# EAGLE design InterfazSensores (EAGLE 7.6.0)
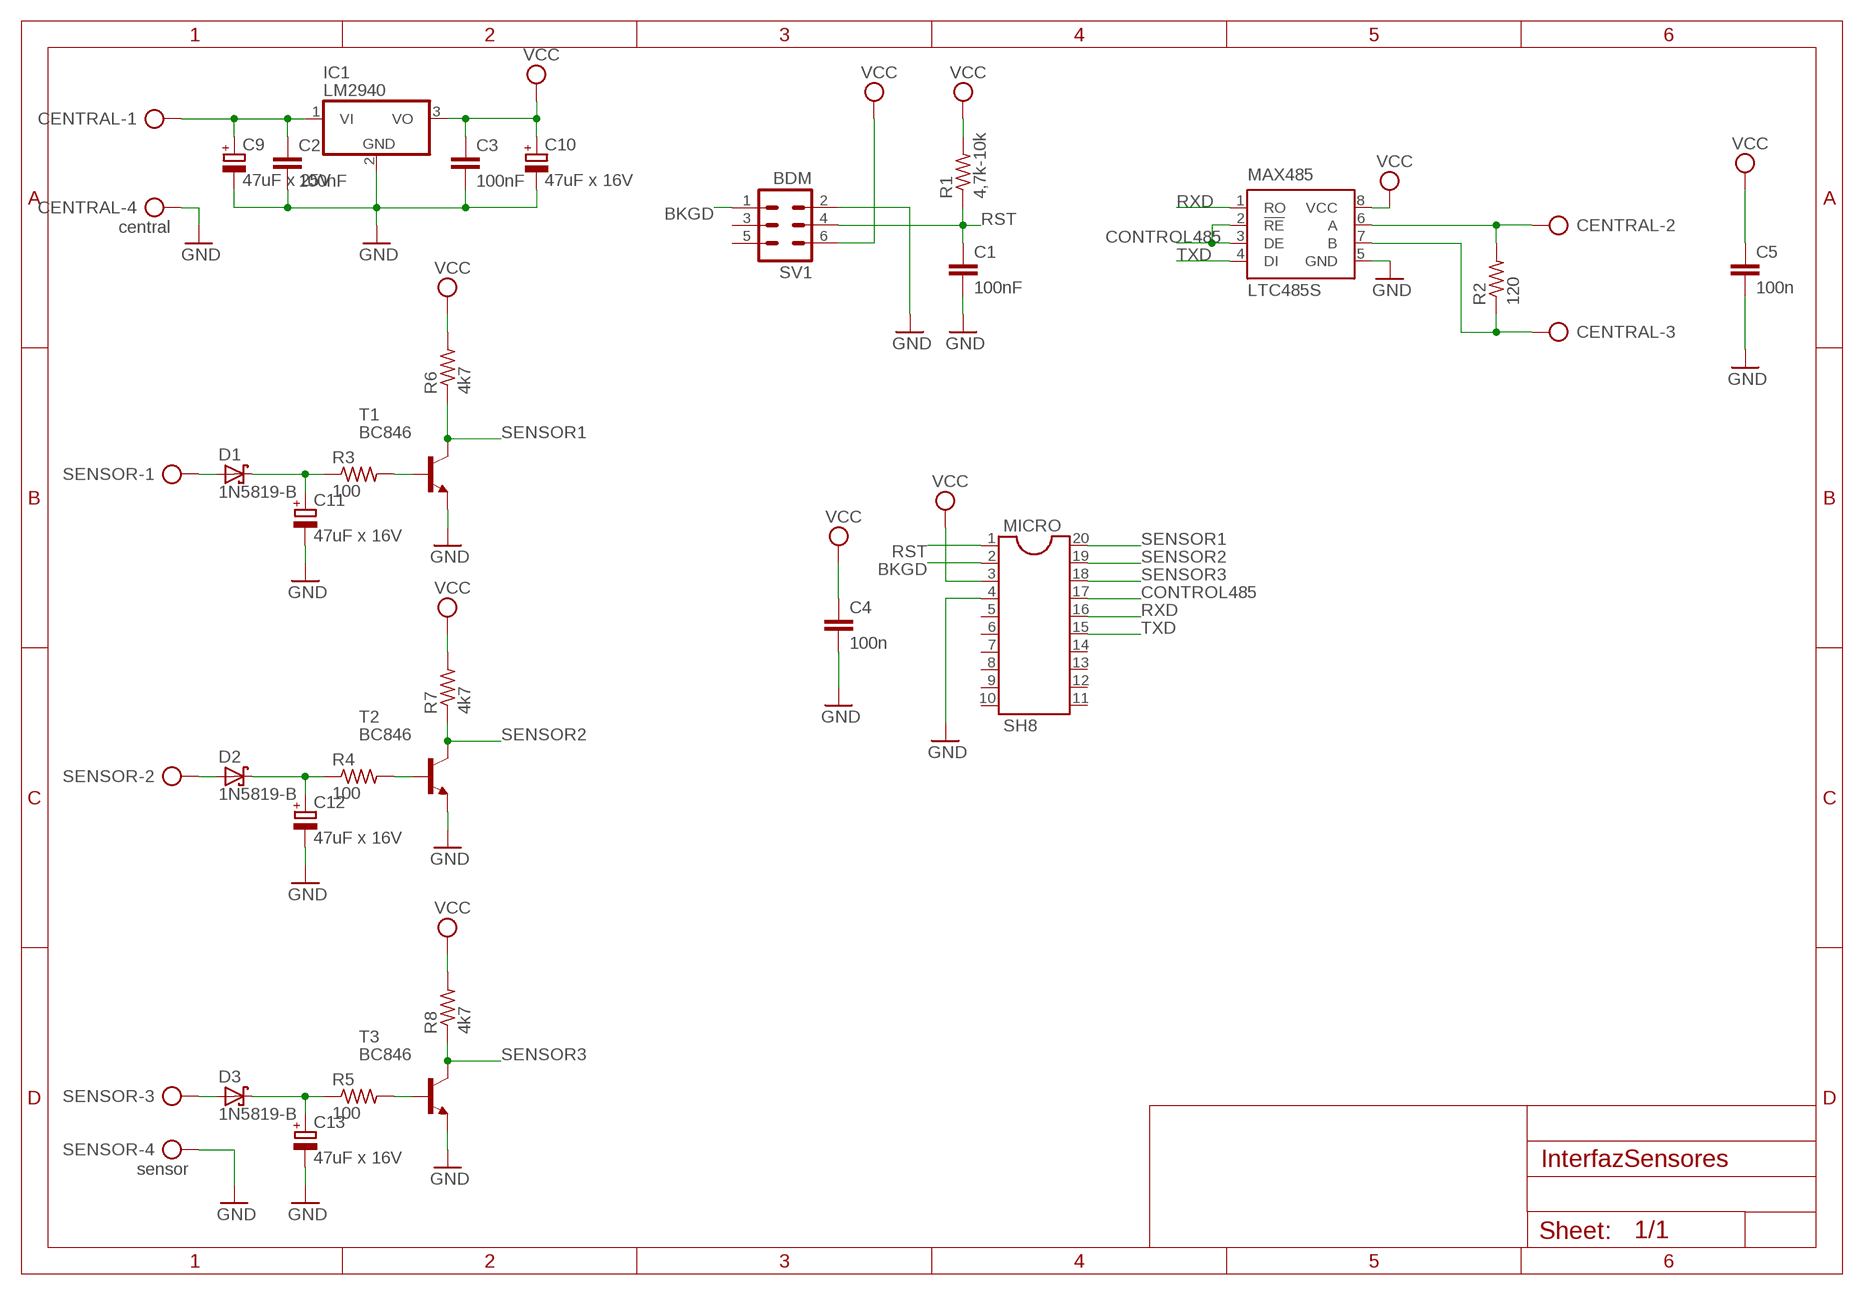
[diagram p0: schematic, sheet 1]

## Parts
C1  100nF  C-EUC0805  [C0805]
C2  100nF  C-EUC0805  [C0805]
C3  100nF  C-EUC0805  [C0805]
C4  100n  C-EUC0805  [C0805]
C5  100n  C-EUC0805  [C0805]
C9  47uF x 25V  CPOL-EUE2,5-6E  [E2,5-6E]
C10  47uF x 16V  CPOL-EUE2,5-6E  [E2,5-6E]
C11  47uF x 16V  CPOL-EUE2,5-6E  [E2,5-6E]
C12  47uF x 16V  CPOL-EUE2,5-6E  [E2,5-6E]
C13  47uF x 16V  CPOL-EUE2,5-6E  [E2,5-6E]
CENTRAL  central  AK300/4  [AK300/4]
D1  1N5819-B  [DO41-7.6]
D2  1N5819-B  [DO41-7.6]
D3  1N5819-B  [DO41-7.6]
IC1  LM2940  7805TV  [TO220V]
MAX485  LTC485S  [SOIC8]
MICRO  SH8  DIL20  [DIL20]
R1  4,7k-10k  R-US_R0805  [R0805]
R2  120  R-US_R0805  [R0805]
R3  100  R-US_R0805  [R0805]
R4  100  R-US_R0805  [R0805]
R5  100  R-US_R0805  [R0805]
R6  4k7  R-US_R0805  [R0805]
R7  4k7  R-US_R0805  [R0805]
R8  4k7  R-US_R0805  [R0805]
SENSOR  sensor  AK300/4  [AK300/4]
SV1  BDM  MA03-2  [MA03-2]
T1  BC846  [SOT23]
T2  BC846  [SOT23]
T3  BC846  [SOT23]

## Nets
BKGD: MICRO.2 SV1.1
CONTROL485: MAX485.2(!RE) MAX485.3(DE) MICRO.17
GND: C1.2 C2.2 C3.2 C4.2 C5.2 C9.- C10.- C11.- C12.- C13.- CENTRAL.4 IC1.2(GND) MAX485.5(GND) MICRO.4 SENSOR.4 SV1.2 T1.2(E) T2.2(E) T3.2(E)
N$1: C2.1 C9.+ CENTRAL.1 IC1.1(VI)
N$2: CENTRAL.2 MAX485.6(A) R2.2
N$3: CENTRAL.3 MAX485.7(B) R2.1
N$4: D1.A SENSOR.1
N$5: D2.A SENSOR.2
N$6: D3.A SENSOR.3
N$7: C11.+ D1.C R3.1
N$8: C12.+ D2.C R4.1
N$9: C13.+ D3.C R5.1
N$10: R5.2 T3.1(B)
N$12: R4.2 T2.1(B)
N$14: R3.2 T1.1(B)
RST: C1.1 MICRO.1 R1.1 SV1.4
RXD: MAX485.1(RO) MICRO.16
SENSOR1: MICRO.20 R6.1 T1.3(C)
SENSOR2: MICRO.19 R7.1 T2.3(C)
SENSOR3: MICRO.18 R8.1 T3.3(C)
TXD: MAX485.4(DI) MICRO.15
VCC: C3.1 C4.1 C5.1 C10.+ IC1.3(VO) MAX485.8(VCC) MICRO.3 R1.2 R6.2 R7.2 R8.2 SV1.6
Unconnected: MICRO.5 MICRO.6 MICRO.7 MICRO.8 MICRO.9 MICRO.10 MICRO.11 MICRO.12 MICRO.13 MICRO.14 SV1.3 SV1.5

## Library data of the parts
C1-C5 = resistor:C-EU: CAPACITOR, European symbol
C9-C13 = rcl:CPOL-EU: POLARIZED CAPACITOR, European symbol
CENTRAL SENSOR = con-ptr500:AK300/4: CONNECTOR; OC_FARNELL: unknown; OC_NEWARK: unknown
D1-D3 = diode:1N581*: 1.0A SCHOTTKY BARRIER RECTIFIER Source: http://www.diodes.com/datasheets/ds23001.pdf
IC1 = linear:78*: Positive VOLTAGE REGULATOR Source: http://cache.national.com/ds/LM/LM78L05.pdf http://www.fairchildsemi.com/ds/LM/LM7805.pdf
MAX485 = linear-technology:LTC485: Low Power RS485 Interface Transceiver Source: http://www.linear.com/pc/downloadDocument.do?navId=H0,C1,C1007,C1017,P2064,D1718; OC_FARNELL: unknown; OC_NEWARK: unknown
MICRO = ic-package:DIL20: Dual In Line / Socket
R1-R8 = resistor:R-US_: RESISTOR, American symbol
SV1 = con-lstb:MA03-2: PIN HEADER; OC_FARNELL: unknown; OC_NEWARK: unknown
T1-T3 = transistor:BC846: NPN TRANSISTOR

## Board
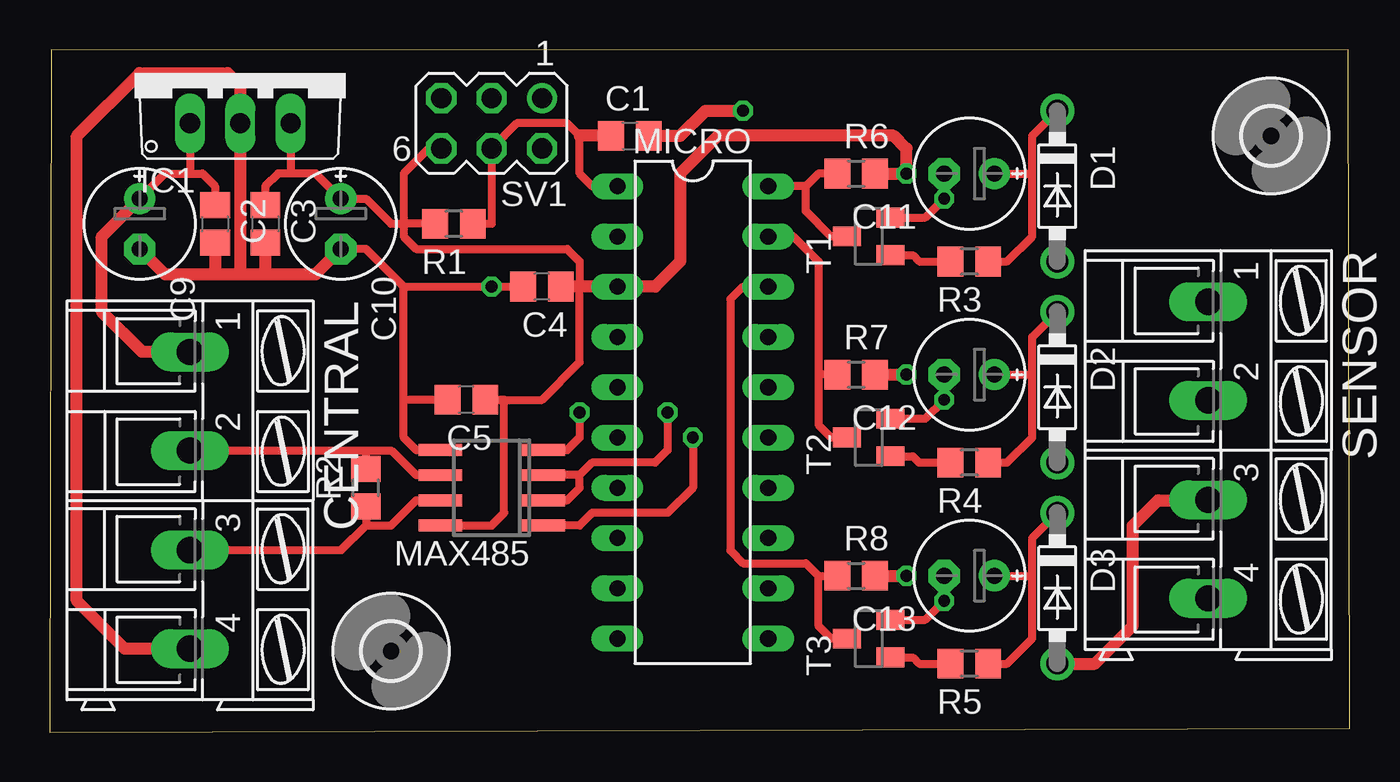
[diagram p1: board, top side]
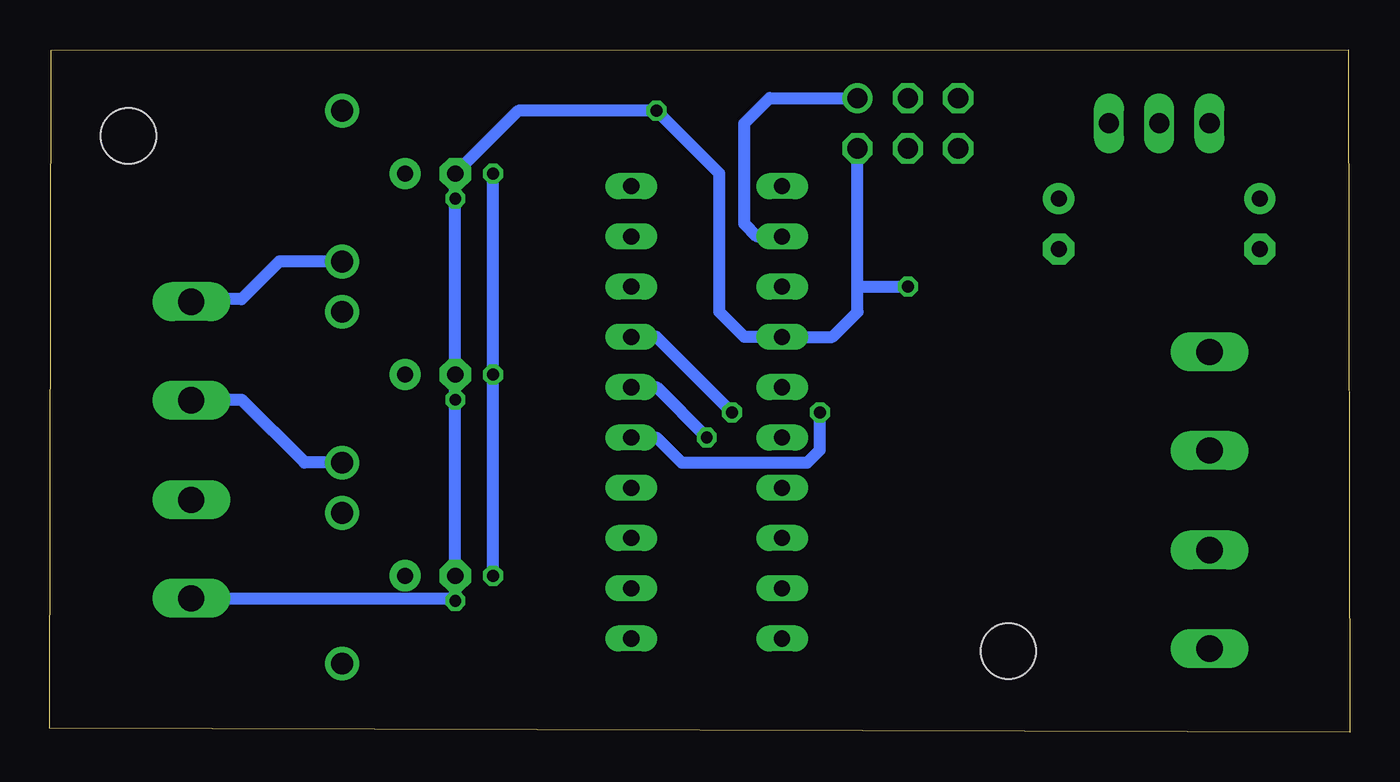
[diagram p2: board, bottom side, seen from below]

Size 65.69 x 34.5 mm. Coordinates in mm from the lower left corner, seen from the top.
Outline: 0.1,34.5 0,0 65.69,0.2 65.59,34.45 0.1,34.5
Copper layers (1*16): Top 0.035mm / dielectric 1.5mm / Bottom 0.035mm
Design rules "default": minimum track width 10mil, minimum drill 24mil, track to track 8mil, track to pad 8mil, pad to pad 8mil, via to via 8mil, smd to smd 8mil, copper to edge 40mil, drill to drill 8mil, minimum pad ring 10mil, minimum via ring 8mil, stop-mask expansion 4mil, vias tented up to drill 0mil, thermal gap 10mil

### Footprints (pad centres in the part's own frame; a part is rotated, then mirrored left to right if it is on the bottom)
C0805 = smd 1.3 x 1.5: 1 -0.95,0; 2 0.95,0
E2,5-6E = drill 0.813 pad 1.575: + -1.27,0 | drill 0.813 pad 1.575 octagon: - 1.27,0
AK300/4 = drill 1.321 long: 1 -7.493,0; 2 -2.515,0; 3 2.515,0; 4 7.493,0
DO41-7.6 = drill 1.1 pad 1.7: A 3.81,0; C -3.81,0
TO220V = drill 1.016 long: 1 -2.54,-2.54; 2 0,-2.54; 3 2.54,-2.54
SOIC8 = smd 0.6 x 2.2: 1 -1.905,-2.6; 2 -0.635,-2.6; 3 0.635,-2.6; 4 1.905,-2.6; 5 1.905,2.6; 6 0.635,2.6; 7 -0.635,2.6; 8 -1.905,2.6
DIL20 = drill 0.813 long: 1 -11.43,-3.81; 2 -8.89,-3.81; 3 -6.35,-3.81; 4 -3.81,-3.81; 5 -1.27,-3.81; 6 1.27,-3.81; 7 3.81,-3.81; 8 6.35,-3.81; 9 8.89,-3.81; 10 11.43,-3.81; 11 11.43,3.81; 12 8.89,3.81; 13 6.35,3.81; 14 3.81,3.81; 15 1.27,3.81; 16 -1.27,3.81; 17 -3.81,3.81; 18 -6.35,3.81; 19 -8.89,3.81; 20 -11.43,3.81
R0805 = smd 1.3 x 1.5: 1 -0.95,0; 2 0.95,0
MA03-2 = drill 1.016: 1 -2.54,-1.27 | drill 1.016 octagon: 2 -2.54,1.27; 3 0,-1.27; 4 0,1.27; 5 2.54,-1.27; 6 2.54,1.27
SOT23 = smd 1 x 1.4: 1 -0.95,-1.1; 2 0.95,-1.1; 3 0,1.1
2,8 = hole 2.8: 0,0

### Placement (x,y rotation side)
C1  29.32,30.13 0 top
C2  8.37,25.69 270 top
C3  10.9,25.69 270 top
C4  24.88,22.52 180 top
C5  21.06,16.8 180 top
C9  4.56,25.69 270 top
C10  14.71,25.69 270 top
C11  46.46,28.23 180 top
C12  46.46,18.07 180 top
C13  46.46,7.91 180 top
CENTRAL  7.1,11.72 270 top
D1  50.91,27.59 270 top
D2  50.91,17.43 270 top
D3  50.91,7.28 270 top
IC1  9.63,33.31 0 top
MAX485  22.34,12.35 90 top
MICRO  32.49,16.16 270 top
R1  20.43,25.69 180 top
R2  15.98,12.35 90 top
R3  46.46,23.79 180 top
R4  46.46,13.62 180 top
R5  46.46,3.46 180 top
R6  40.75,28.23 0 top
R7  40.75,18.07 0 top
R8  40.75,7.91 0 top
SENSOR  58.53,14.26 270 top
SV1  22.34,30.77 180 top
T1  41.38,25.05 90 top
T2  41.38,14.89 90 top
T3  41.38,4.74 90 top
U$1  [2,8]  61.7,30.13 270 top
U$3  [2,8]  17.25,4.1 270 top

### Tracks (layer width: path | path; a pad name or v marks a point on that pad's centre or on a via)
BKGD
  Bottom 0.61: MICRO.2 29.95,25.05 30.59,25.69 30.59,30.77 29.32,32.04 SV1.1
CONTROL485  (via drill 0.6)
  Top 0.406: v31.22,16.16 31.22,14.26 30.59,13.62 27.41,13.62 26.78,12.99 | 26.78,12.99 MAX485.3 | MAX485.2 26.14,11.72 26.78,12.35 26.78,12.99
  Bottom 0.61: MICRO.17 35.03,19.97 v31.22,16.16
GND  (via drill 0.6)
  Top 0.406: T3.2 44.24,5.68 v45.2,6.64 C13.- | T2.2 44.24,15.84 v45.2,16.8 C12.- | T1.2 44.24,26 v45.2,26.96 C11.- | MAX485.5 18.52,14.26 17.89,14.89 17.89,16.8 | C5.2 17.89,16.8 | 17.89,16.8 17.89,22.52 | 17.89,22.52 15.98,24.42 C10.- | 17.89,22.52 v22.34,22.52 C4.2
  Top 0.61: C9.- 5.83,23.15 8.37,23.15 | 8.37,23.15 9.63,23.15 | 9.63,23.15 10.9,23.15 | 10.9,23.15 13.45,23.15 C10.- | C3.2 10.9,23.15 | C2.2 8.37,23.15 | C1.2 31.86,30.13 33.13,31.4 v35.03,31.4 | CENTRAL.4 3.79,4.23 1.38,6.64 1.38,30.13 4.56,33.31 9,33.31 9.63,32.67 IC1.2 9.63,23.15
  Bottom 0.61: SENSOR.4 45.32,6.77 v45.2,6.64 | C13.- v45.2,6.64 | v45.2,6.64 v45.2,16.8 C12.- v45.2,26.96 C11.- 42.02,31.4 v35.03,31.4 31.86,28.23 31.86,21.24 30.59,19.97 MICRO.4 26.14,19.97 24.88,21.24 24.88,22.52 | 24.88,22.52 SV1.2 | 24.88,22.52 v22.34,22.52
N$1
  Top 0.406: C9.+ 5.83,28.23 7.1,28.23 | 7.1,28.23 7.73,28.23 8.37,27.59 C2.1 | IC1.1 7.1,28.23
  Top 0.61: CENTRAL.1 4.68,19.21 2.65,21.24 2.65,25.05 C9.+
N$2
  Top 0.406: CENTRAL.2 15.98,14.23 | 15.98,14.23 17.28,14.23 18.52,12.99 MAX485.6 | R2.2 15.98,14.23
N$3
  Top 0.406: CENTRAL.3 14.74,9.2 15.98,10.45 | 15.98,10.45 17.25,10.45 18.52,11.72 MAX485.7 | R2.1 15.98,10.45
N$4
  Bottom 0.61: D1.A 54.09,23.79 55.99,21.88 58.4,21.88 SENSOR.1
N$5
  Bottom 0.61: D2.A 52.81,13.62 55.99,16.8 58.51,16.8 SENSOR.2
N$6
  Top 0.61: D3.A 52.81,3.46 54.72,5.37 54.72,10.45 55.99,11.72 58.51,11.72 SENSOR.3
N$7
  Top 0.406: R3.1 48.37,23.79 49.64,25.05 49.64,28.23 | 49.64,28.23 49.64,30.13 D1.C | C11.+ 49.64,28.23
N$8
  Top 0.406: R4.1 48.37,13.62 49.64,14.89 49.64,18.07 | 49.64,18.07 49.64,19.97 D2.C | C12.+ 49.64,18.07
N$9
  Top 0.406: R5.1 48.37,3.46 49.64,4.74 49.64,7.91 | 49.64,7.91 49.64,9.81 D3.C | C13.+ 49.64,7.91
N$10
  Top 0.406: T3.1 43.6,3.79 43.92,3.46 R5.2
N$12
  Top 0.406: T2.1 43.6,13.94 43.92,13.62 R4.2
N$14
  Top 0.406: T1.1 43.6,24.11 43.92,23.79 R3.2
RST
  Top 0.406: R1.1 22.34,25.69 SV1.4 23.61,30.77 26.14,30.77 26.78,30.13 26.78,28.23 27.41,27.59 MICRO.1
  Top 0.61: C1.1 26.78,30.13
RXD  (via drill 0.6)
  Top 0.406: v32.49,14.89 32.49,12.35 31.22,11.08 27.41,11.08 26.78,10.45 MAX485.1
  Bottom 0.61: MICRO.16 35.03,17.43 v32.49,14.89
SENSOR1
  Top 0.406: T1.3 39.48,25.05 38.21,26.32 38.21,27.59 | 38.21,27.59 MICRO.20 | R6.1 38.84,28.23 38.21,27.59
SENSOR2
  Top 0.406: MICRO.19 37.58,25.05 38.84,23.79 38.84,18.07 | 38.84,18.07 38.84,15.53 39.48,14.89 T2.3 | R7.1 38.84,18.07
SENSOR3
  Top 0.406: MICRO.18 35.03,22.52 34.4,21.88 34.4,9.18 35.03,8.54 38.21,8.54 38.84,7.91 | 38.84,7.91 R8.1 | T3.3 39.48,4.74 38.84,5.37 38.84,7.91
TXD  (via drill 0.6)
  Top 0.406: v26.78,16.16 26.78,14.89 26.14,14.26 MAX485.4
  Bottom 0.61: MICRO.15 35.03,14.89 33.77,13.62 27.41,13.62 26.78,14.26 v26.78,16.16
VCC  (via drill 0.6)
  Top 0.406: 12.17,28.23 13.45,28.23 C10.+ 15.98,26.96 17.25,25.69 17.89,25.69 | 12.17,28.23 11.54,28.23 10.9,27.59 C3.1 | IC1.3 12.17,28.23 | SV1.6 19.16,29.5 17.89,28.23 17.89,25.69 | R1.2 17.89,25.69 | 17.89,25.69 17.89,25.05 18.52,24.42 26.14,24.42 26.78,23.79 26.78,22.52 26.78,18.7 24.88,16.8 C5.1 22.97,16.8 22.97,11.08 22.34,10.45 MAX485.8
  Top 0.61: R6.2 v43.29,28.23 43.29,29.5 42.66,30.13 33.77,30.13 31.86,28.23 31.86,23.79 30.59,22.52 MICRO.3 26.78,22.52 C4.1 | R8.2 v43.29,7.91 | R7.2 v43.29,18.07
  Bottom 0.61: v43.29,7.91 v43.29,18.07 v43.29,28.23